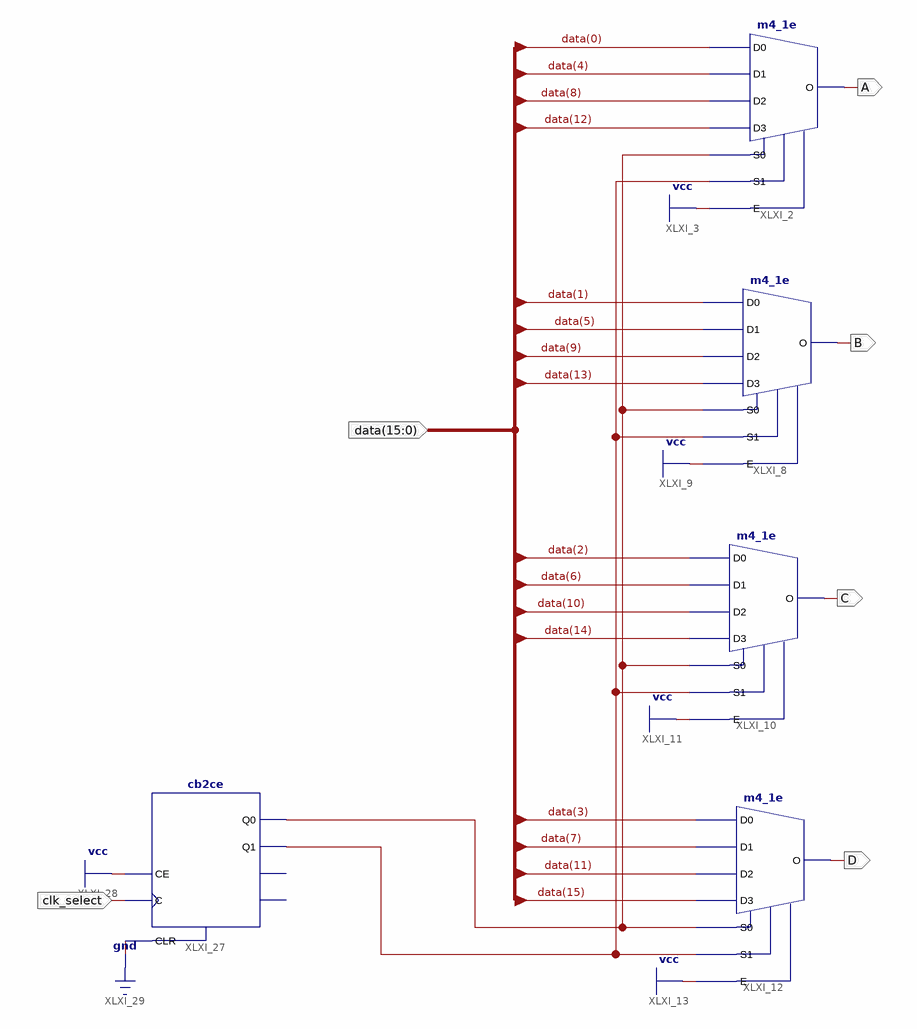
[diagram p0: schematic sheet 1]
// Xilinx ISE schematic Mux16.sch (spartan6) as structural Verilog: 5 symbols, 6 ports
module Mux16 (
  input  [15:0] data,
  input  clk_select,
  output A,
  output B,
  output C,
  output D
);

  wire S0, S1;

  m4_1e XLXI_2 (.D0(data[0]), .D1(data[4]), .D2(data[8]), .D3(data[12]), .E(1'b1), .S0(S0), .S1(S1), .O(A));
  m4_1e XLXI_8 (.D0(data[1]), .D1(data[5]), .D2(data[9]), .D3(data[13]), .E(1'b1), .S0(S0), .S1(S1), .O(B));
  m4_1e XLXI_10 (.D0(data[2]), .D1(data[6]), .D2(data[10]), .D3(data[14]), .E(1'b1), .S0(S0), .S1(S1), .O(C));
  m4_1e XLXI_12 (.D0(data[3]), .D1(data[7]), .D2(data[11]), .D3(data[15]), .E(1'b1), .S0(S0), .S1(S1), .O(D));
  cb2ce XLXI_27 (.C(clk_select), .CE(1'b1), .CLR(1'b0), .Q0(S0), .Q1(S1));  // open: CEO, TC
endmodule
